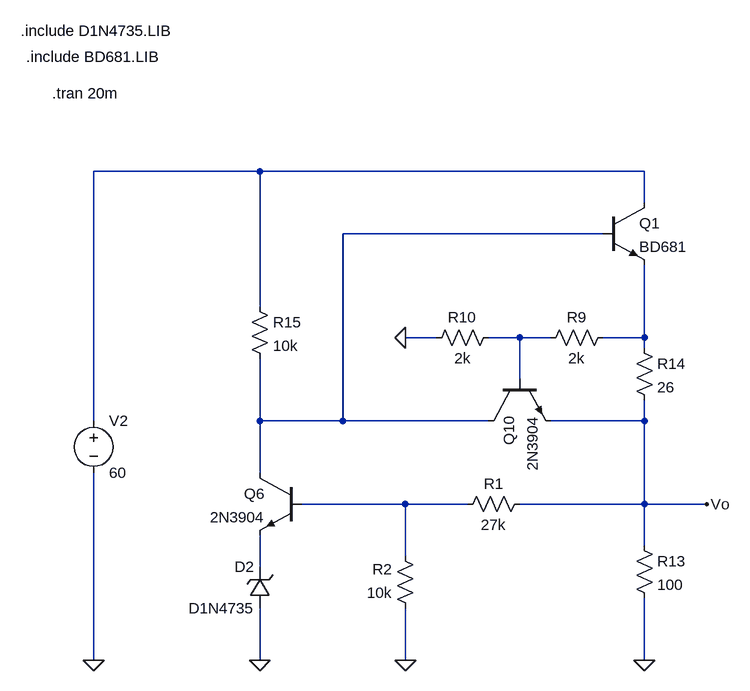
[diagram p0: schematic ReguladorConLimitador.asc]
ReguladorConLimitador.asc, the LTspice schematic file:
Version 4
SHEET 1 3356 680
WIRE 2624 -816 2368 -816
WIRE 3216 -816 2624 -816
WIRE 3216 -768 3216 -816
WIRE 3152 -720 2752 -720
WIRE 2624 -608 2624 -816
WIRE 2896 -560 2848 -560
WIRE 3024 -560 2976 -560
WIRE 3072 -560 3024 -560
WIRE 3216 -560 3216 -672
WIRE 3216 -560 3152 -560
WIRE 3216 -544 3216 -560
WIRE 3024 -496 3024 -560
WIRE 2368 -432 2368 -816
WIRE 2624 -432 2624 -528
WIRE 2752 -432 2752 -720
WIRE 2752 -432 2624 -432
WIRE 2976 -432 2752 -432
WIRE 3216 -432 3216 -464
WIRE 3216 -432 3072 -432
WIRE 2624 -352 2624 -432
WIRE 2848 -304 2688 -304
WIRE 2944 -304 2848 -304
WIRE 3216 -304 3216 -432
WIRE 3216 -304 3024 -304
WIRE 3312 -304 3216 -304
WIRE 3216 -240 3216 -304
WIRE 2848 -224 2848 -304
WIRE 2624 -208 2624 -256
WIRE 2368 -64 2368 -352
WIRE 2624 -64 2624 -144
WIRE 2848 -64 2848 -144
WIRE 3216 -64 3216 -160
FLAG 2848 -64 0
FLAG 3216 -64 0
FLAG 2624 -64 0
FLAG 2848 -560 0
FLAG 2368 -64 0
FLAG 3312 -304 Vo
SYMBOL voltage 2368 -448 R0
WINDOW 123 0 0 Left 2
WINDOW 39 0 0 Left 2
SYMATTR InstName V2
SYMATTR Value 60
SYMBOL npn 2976 -496 M90
SYMATTR InstName Q10
SYMATTR Value 2N3904
SYMBOL res 3168 -576 R90
WINDOW 0 0 56 VBottom 2
WINDOW 3 32 56 VTop 2
SYMATTR InstName R9
SYMATTR Value 2k
SYMBOL res 2992 -576 R90
WINDOW 0 0 56 VBottom 2
WINDOW 3 32 56 VTop 2
SYMATTR InstName R10
SYMATTR Value 2k
SYMBOL res 3040 -320 R90
WINDOW 0 0 56 VBottom 2
WINDOW 3 32 56 VTop 2
SYMATTR InstName R1
SYMATTR Value 27k
SYMBOL res 2864 -128 R180
WINDOW 0 36 76 Left 2
WINDOW 3 36 40 Left 2
SYMATTR InstName R2
SYMATTR Value 10k
SYMBOL res 3200 -560 R0
SYMATTR InstName R14
SYMATTR Value 26
SYMBOL zener 2640 -144 R180
WINDOW 0 24 64 Left 2
WINDOW 3 24 0 Left 2
SYMATTR InstName D2
SYMATTR Value D1N4735
SYMATTR Description Diode
SYMATTR Type diode
SYMBOL res 2608 -624 R0
SYMATTR InstName R15
SYMATTR Value 10k
SYMBOL npn 2688 -352 M0
SYMATTR InstName Q6
SYMATTR Value 2N3904
SYMBOL res 3200 -256 R0
SYMATTR InstName R13
SYMATTR Value 100
SYMBOL npn 3152 -768 R0
SYMATTR InstName Q1
SYMATTR Value BD681
SYMATTR Prefix X
TEXT 2304 -936 Left 2 !.tran 20m
TEXT 2256 -1032 Left 2 !.include D1N4735.LIB
TEXT 2264 -992 Left 2 !.include BD681.LIB

The netlist it stands for:
* ReguladorConLimitador.asc
V2 N001 0 60
Q10 N002 N003 Vo 0 2N3904
R9 N004 N003 2k
R10 N003 0 2k
R1 Vo N005 27k
R2 0 N005 10k
R14 N004 Vo 26
D2 0 N006 D1N4735
R15 N001 N002 10k
Q6 N002 N005 N006 0 2N3904
R13 Vo 0 100
XQ1 N001 N002 N004 BD681  ; pins C B E
.model D D
.lib standard.dio
.model NPN NPN
.model PNP PNP
.lib standard.bjt
.tran 20m
.include D1N4735.LIB
.include BD681.LIB
.backanno
.end